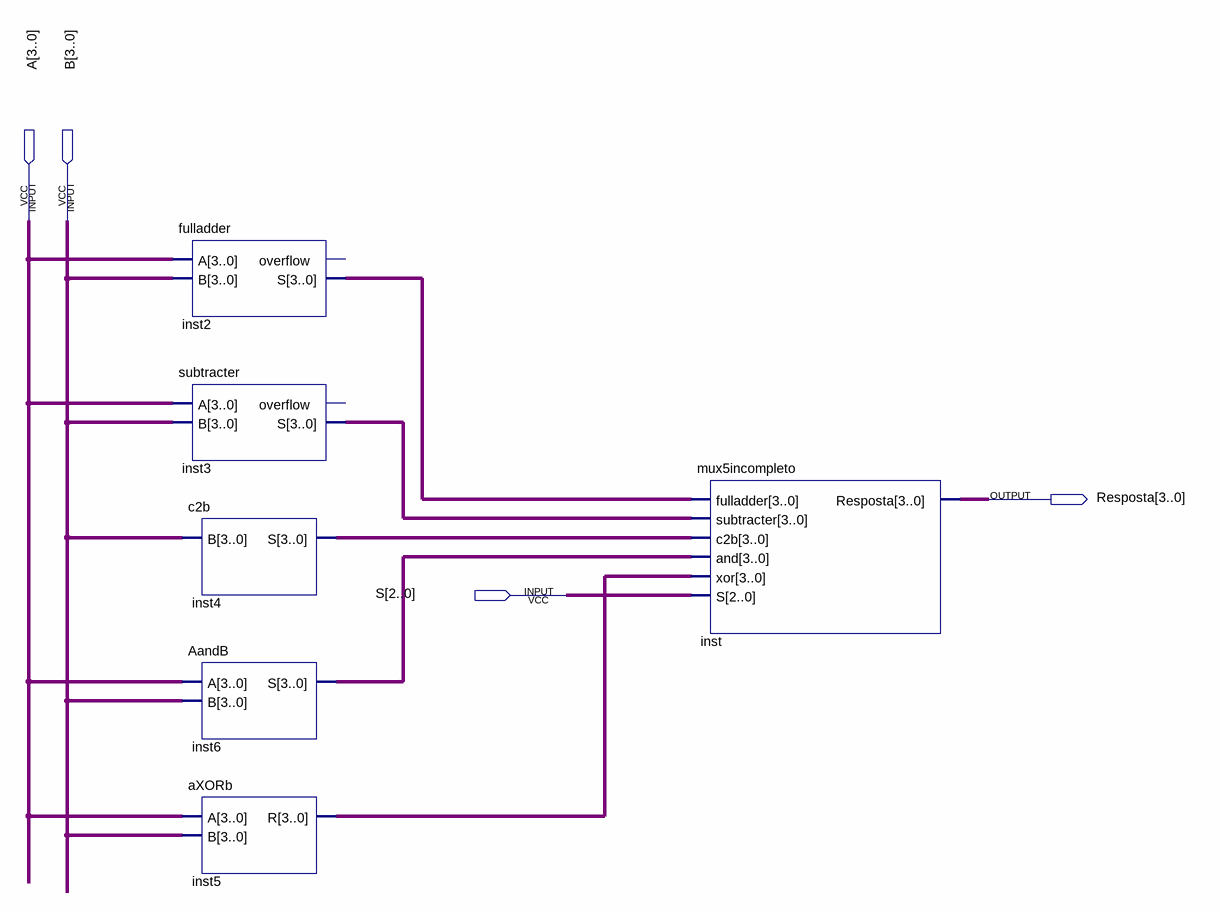
[diagram p0: schematic sheet]
// Quartus schematic testemux5.bdf as structural Verilog: 6 symbols, 4 pins
module testemux5 (
  input  [3:0] A,
  input  [3:0] B,
  input  [2:0] S,
  output [3:0] Resposta
);

  wire [3:0] inst2_s, inst3_s, inst4_s, inst5_r, inst6_s;

  fulladder inst2 (.A(A), .B(B), .S(inst2_s));  // open: overflow
  subtracter inst3 (.A(A), .B(B), .S(inst3_s));  // open: overflow
  c2b inst4 (.B(B), .S(inst4_s));
  AandB inst6 (.A(A), .B(B), .S(inst6_s));
  aXORb inst5 (.A(A), .B(B), .R(inst5_r));
  mux5incompleto inst (
    .fulladder(inst2_s), .subtracter(inst3_s), .c2b(inst4_s), .\and (inst6_s), .\xor (inst5_r), .S(S),
    .Resposta(Resposta));
endmodule
